# EAGLE design XBee-Adapter_v10 (EAGLE 7.7.0)
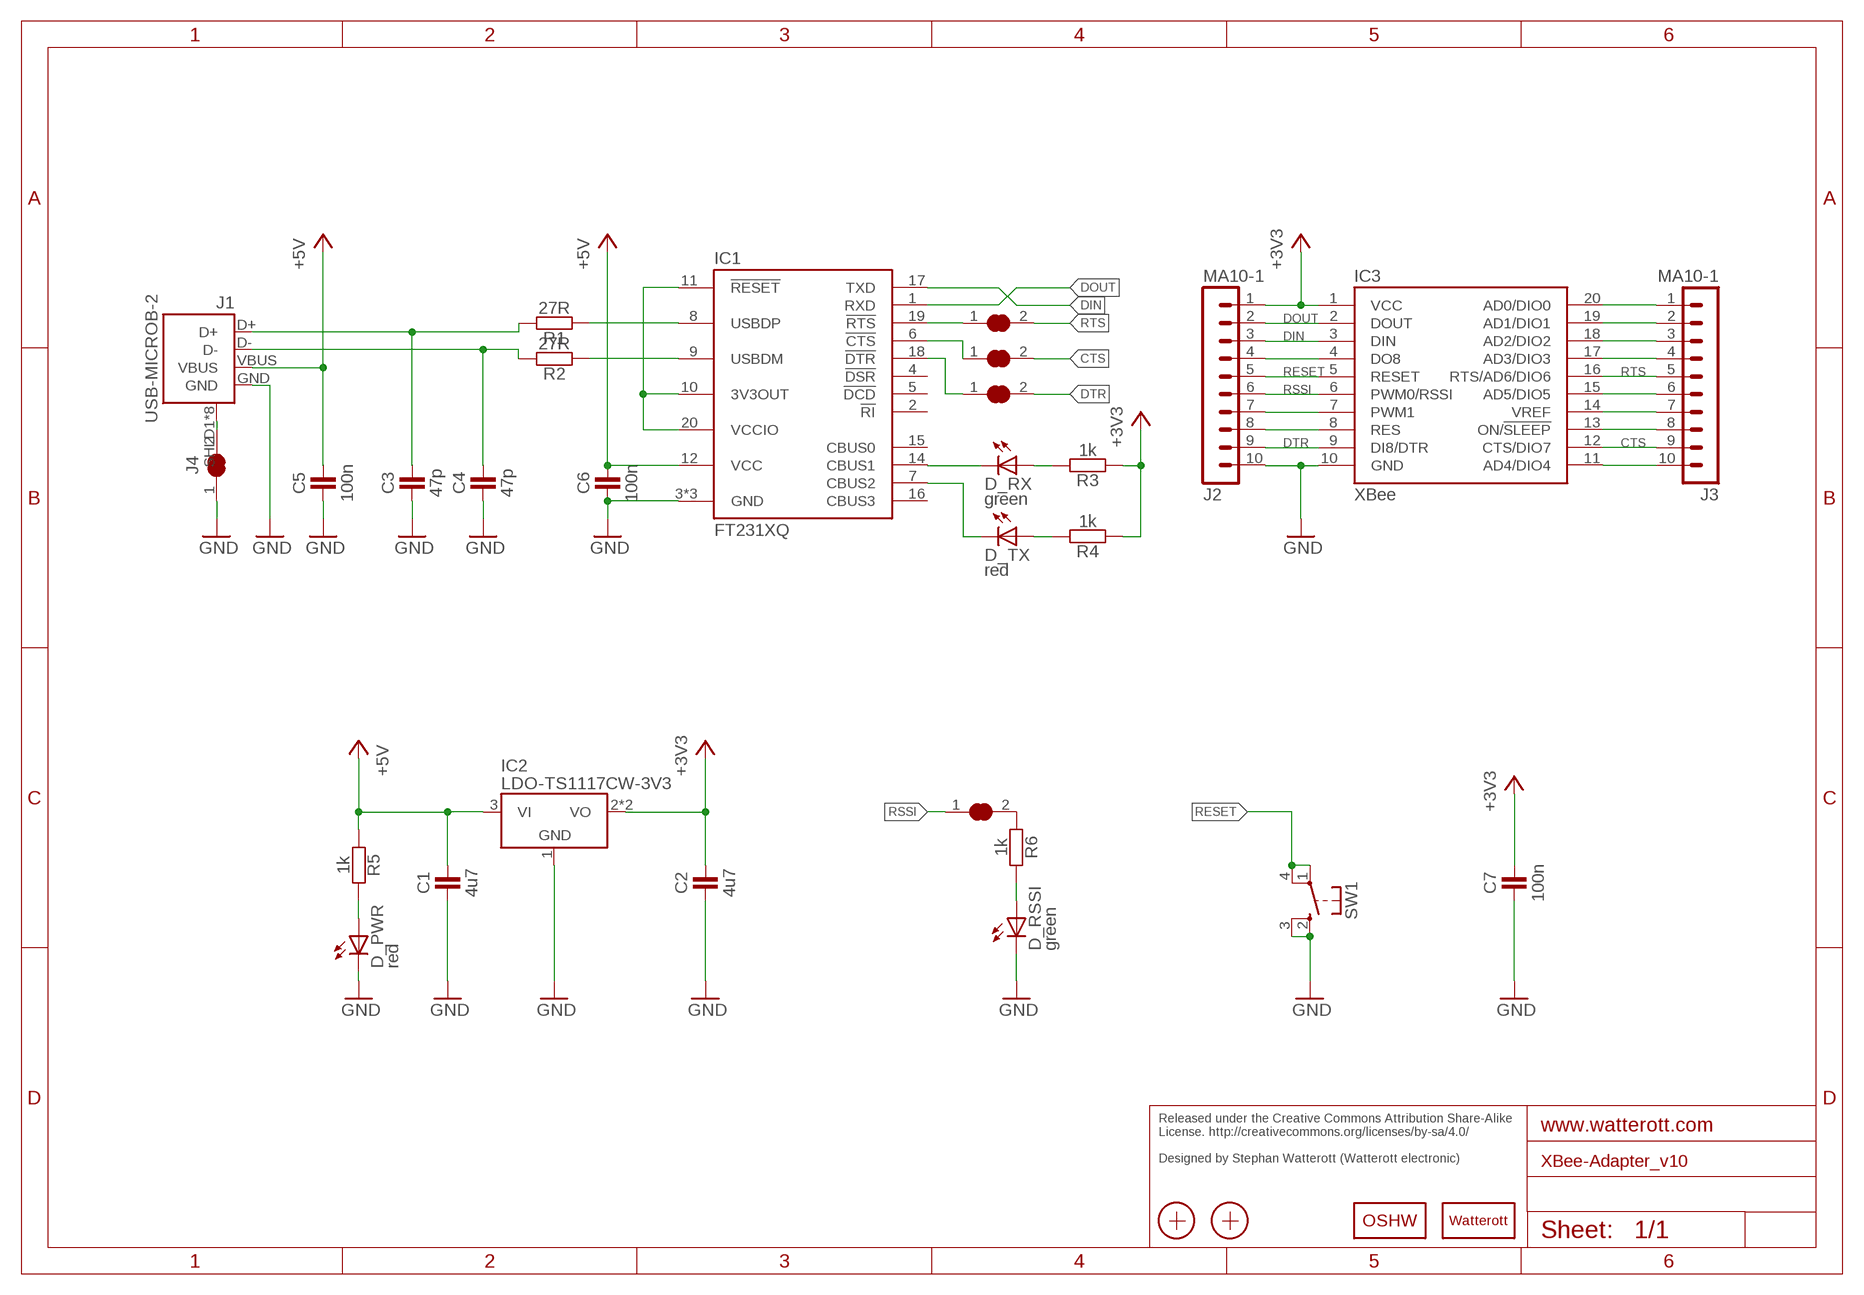
[diagram p0: schematic, sheet 1]

## Parts
C1  4u7  CAPACITOR-0402  [C0402]
C2  4u7  CAPACITOR-0402  [C0402]
C3  47p  CAPACITOR-0402  [C0402]
C4  47p  CAPACITOR-0402  [C0402]
C5  100n  CAPACITOR-0402  [C0402]
C6  100n  CAPACITOR-0402  [C0402]
C7  100n  CAPACITOR-0402  [C0402]
CTS  JUMPER2-0603  [JUMPER2-0603]
D_PWR  red  LED-0603  [C0603]
D_RSSI  green  LED-0603  [C0603]
D_RX  green  LED-0603  [C0603]
D_TX  red  LED-0603  [C0603]
DTR  JUMPER2-0603  [JUMPER2-0603]
IC1  FT231XQ  [QFN20-PAD]
IC2  LDO-TS1117CW-3V3  [SOT223]
IC3  XBee  XBEE  [XBEE]
J1  USB-MICROB-2  [USB-MICROB-10118194]
J2  MA10-1  [MA10-1]
J3  MA10-1  [MA10-1]
J4  JUMPER2-0603  [JUMPER2-0603]
LOGO1  OSHW_LOGOX0150  [OSHW_6X150]
LOGO2  LOGO-S_PLACE_M  [SPARK_TPLACE_M]
R1  27R  RESISTOR-0402  [C0402]
R2  27R  RESISTOR-0402  [C0402]
R3  1k  RESISTOR-0402  [C0402]
R4  1k  RESISTOR-0402  [C0402]
R5  1k  RESISTOR-0402  [C0402]
R6  1k  RESISTOR-0402  [C0402]
RSSI  JUMPER2-0603  [JUMPER2-0603]
RTS  JUMPER2-0603  [JUMPER2-0603]
SW1  SW-TACTILE-TL3315  [SW_TL3315N]
X1  PASSER-07  [PASSER_07MM]
X2  PASSER-07  [PASSER_07MM]

## Nets
+3V3: C2.2 C7.2 IC2.2(VO) IC2.4(VO) IC3.1(VCC) J2.1 R3.1 R4.1
+5V: C1.2 C5.2 C6.2 IC1.12(VCC) IC2.3(VI) J1.VBUS R5.1
CTS: CTS.2 IC3.12(CTS/DIO7) J3.9
D_N: C4.2 J1.D- R2.2
D_P: C3.2 J1.D+ R1.2
DIN: IC1.17(TXD) IC3.3(DIN) J2.3
DOUT: IC1.1(RXD) IC3.2(DOUT) J2.2
DTR: DTR.2 IC3.9(DI8/DTR) J2.9
GND: C1.1 C2.1 C3.1 C4.1 C5.1 C6.1 C7.1 D_PWR.C D_RSSI.C IC1.3(GND) IC1.13(GND) IC1.TP(GND) IC2.1(GND) IC3.10(GND) J1.GND J2.10 J4.1 SW1.2(S1) SW1.3(S2)
N$1: D_PWR.A R5.2
N$2: D_RSSI.A R6.2
N$3: R6.1 RSSI.2
N$6: J1.SHLD1(SHIELD) J1.SHLD2(SHIELD) J1.SHLD3(SHIELD) J1.SHLD4(SHIELD) J1.SHLD5(SHIELD) J1.SHLD6(SHIELD) J1.SHLD7(SHIELD) J1.SHLD8(SHIELD) J4.2
N$8: IC1.19(!RTS) RTS.1
N$10: CTS.1 IC1.6(!CTS)
N$11: D_RX.C IC1.14(CBUS1)
N$12: D_TX.C IC1.7(CBUS2)
N$13: D_RX.A R3.2
N$14: D_TX.A R4.2
N$15: DTR.1 IC1.18(!DTR)
N$17: IC3.4(DO8) J2.4
N$20: IC3.7(PWM1) J2.7
N$21: IC3.8(RES) J2.8
N$23: IC3.20(AD0/DIO0) J3.1
N$24: IC3.19(AD1/DIO1) J3.2
N$25: IC3.18(AD2/DIO2) J3.3
N$26: IC3.17(AD3/DIO3) J3.4
N$27: IC3.15(AD5/DIO5) J3.6
N$28: IC3.14(VREF) J3.7
N$29: IC3.13(ON/!SLEEP) J3.8
N$30: IC3.11(AD4/DIO4) J3.10
RESET: IC3.5(RESET) J2.5 SW1.1 SW1.4(P2)
RSSI: IC3.6(PWM0/RSSI) J2.6 RSSI.1
RTS: IC3.16(RTS/AD6/DIO6) J3.5 RTS.2
USB_N: IC1.9(USBDM) R2.1
USB_P: IC1.8(USBDP) R1.1
VCCIO: IC1.10(3V3OUT) IC1.11(!RESET) IC1.20(VCCIO)
Unconnected: IC1.2(!RI) IC1.4(!DSR) IC1.5(!DCD) IC1.15(CBUS0) IC1.16(CBUS3)

## Notes on the sheet
- Released under the Creative Commons Attribution Share-Alike 
  License. http://creativecommons.org/licenses/by-sa/4.0/
  
  Designed by Stephan Watterott (Watterott electronic)

## Library data of the parts
C1-C7 = we-rcl:CAPACITOR: Capacitors ...4.7uF @ 6.3V -> 0402 ...10uF @ 16V -> 0603 ...22uF @ 25V -> 0805
CTS DTR J4 RSSI RTS = we-rcl:JUMPER2: 2 Pin Jumpers
D_PWR D_RSSI D_RX D_TX = we-opto:LED: LEDs
IC1 = we-chip:FT231X: FTDI FT231X USB to UART Bridge (5V tolerant inputs); DIGIKEY: 768-1128-6-ND
IC2 = we-power:LDO: LDOs TS1117 800mA, Vin max 12V - compatible NCP1117 1A, Vin max 20V TS9011 250mA, Vin max 12V - compatible AP2210 300mA, Vin max 15V TS5204 150mA, Vin max 16V
IC3 = we-board:XBEE: XBEE
J1 = we-con:USB: USB Connectors
J2 J3 = we-con:MA10-1: Pin Header
LOGO1 = we-symbol:OSHW_LOGO: Open-Source-Hardware Logo
LOGO2 = we-symbol:LOGO: Watterott electronic Logo
R1-R6 = we-rcl:RESISTOR: Resistors all kinds in 0603 and 0402
SW1 = we-switch:SW-TACTILE: Tactile Switches; DIGIKEY: EG4621TR-ND
X1 X2 = we-symbol:PASSER: Fiducial Markers

## Board
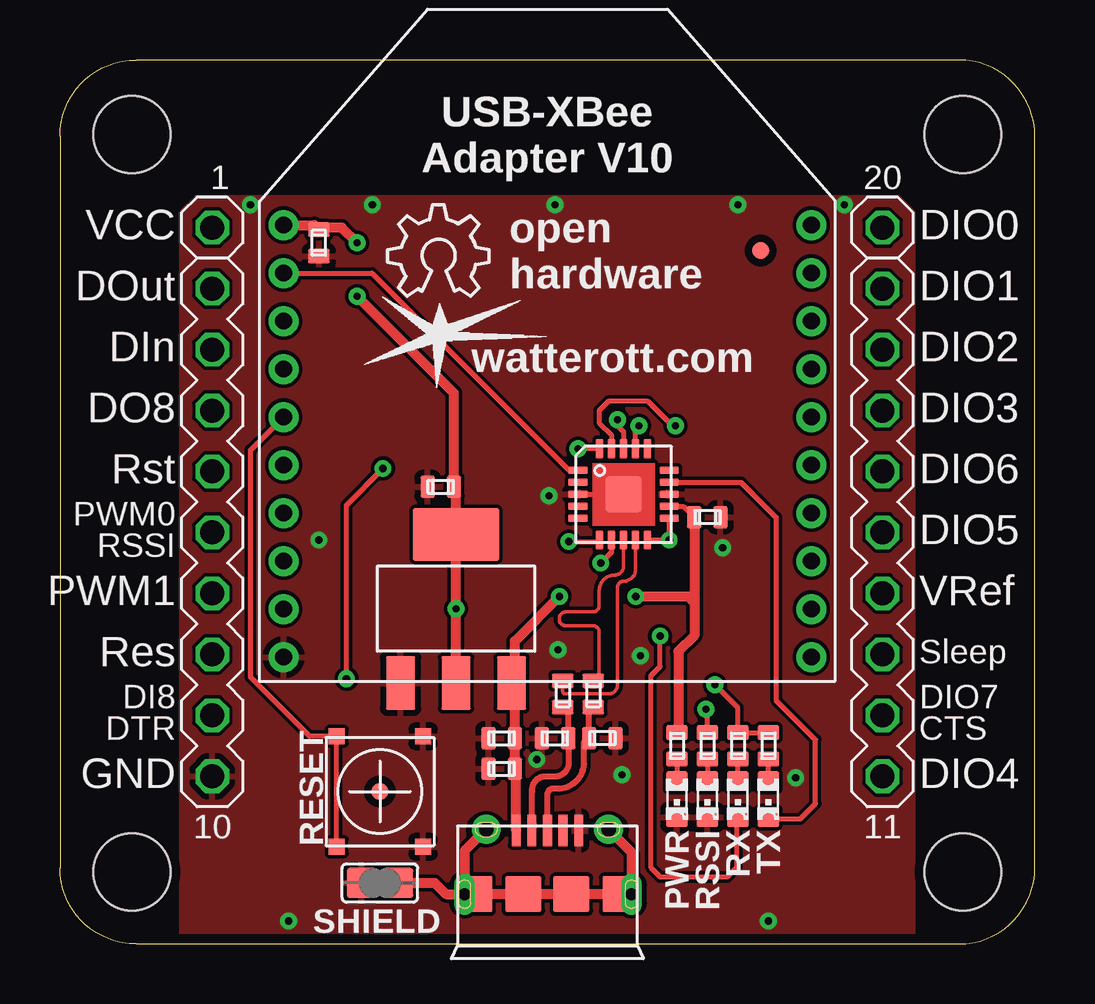
[diagram p1: board, top side]
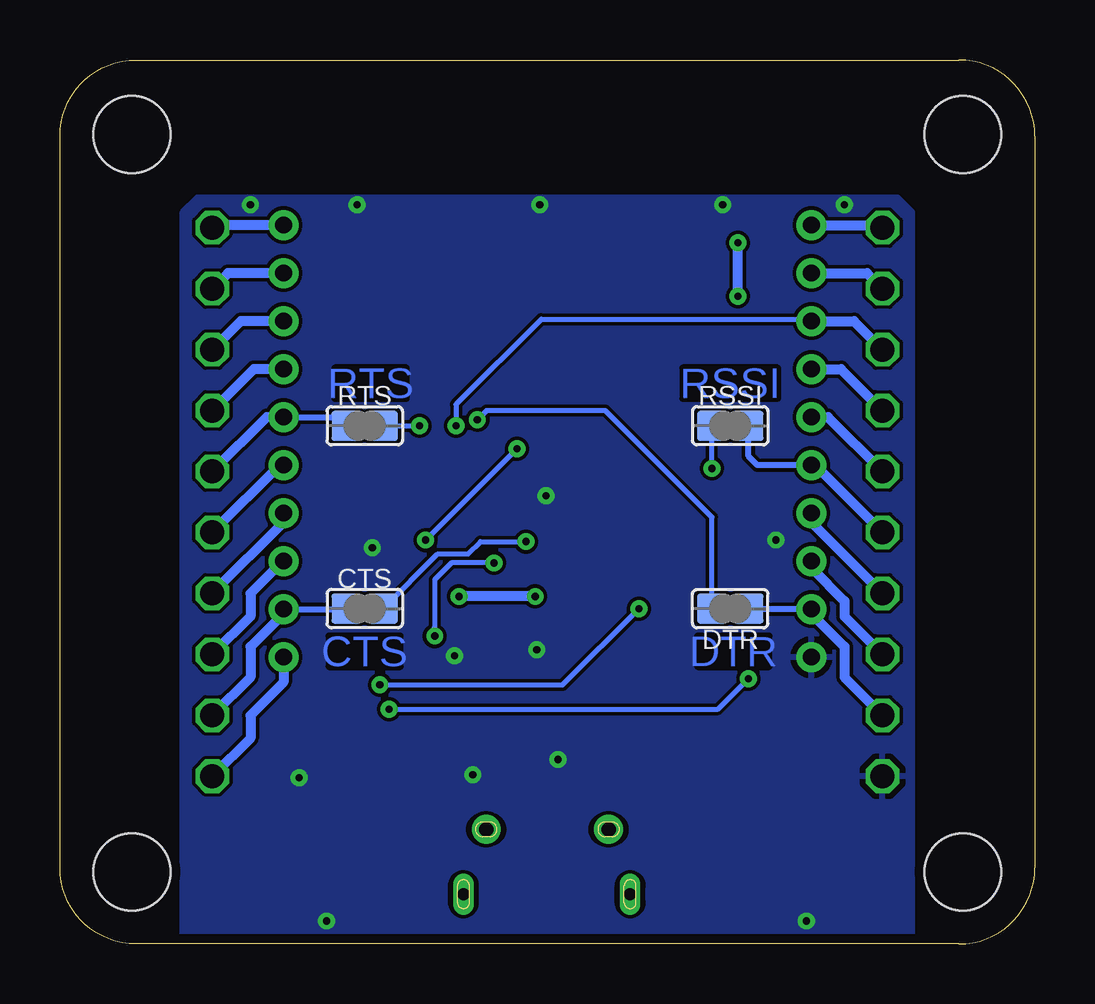
[diagram p2: board, bottom side, seen from below]

Size 40.64 x 36.83 mm. Coordinates in mm from the lower left corner, seen from the top.
Outline: 3.17,0 arc-90 0,3.17 0,33.66 arc-90 3.17,36.83 37.46,36.83 arc-90 40.64,33.66 40.64,3.17 arc-90 37.46,0 3.17,0
Copper layers (1*16): Top 0.035mm / dielectric 1.5mm / Bottom 0.035mm
Design rules "we-dru-2-layer": minimum track width 0.15mm, minimum drill 0.3mm, track to track 0.15mm, track to pad 0.15mm, pad to pad 0.15mm, via to via 0.15mm, smd to smd 0.1mm, copper to edge 0.4mm, drill to drill 0.2mm, minimum pad ring 0.18mm, minimum via ring 0.2mm, stop-mask expansion 0.1mm, vias tented up to drill 0.5mm, thermal gap 0.25mm
Holes 3.2 mm at 3,3 3,33.73 37.64,33.73 37.64,3

### Footprints (pad centres in the part's own frame; a part is rotated, then mirrored left to right if it is on the bottom)
C0402 = smd 0.9 x 0.6: 1 0,0.55; 2 0,-0.55
JUMPER2-0603 = smd 1.25 x 1.25: 1 0,0.76; 2 0,-0.76
C0603 = smd 0.9 x 0.8: A 0,-0.75; C 0,0.75
QFN20-PAD = smd 0.8 x 0.3: 1 -1.9,1; 2 -1.9,0.5; 3 -1.9,0; 4 -1.9,-0.5; 5 -1.9,-1; 11 1.9,-1; 12 1.9,-0.5; 13 1.9,0; 14 1.9,0.5; 15 1.9,1 | smd 0.3 x 0.8: 6 -1,-1.9; 7 -0.5,-1.9; 8 0,-1.9; 9 0.5,-1.9; 10 1,-1.9; 16 1,1.9; 17 0.5,1.9; 18 0,1.9; 19 -0.5,1.9; 20 -1,1.9 | smd 1.5 x 1.5: TP 0,0
SOT223 = smd 2.235 x 1.219: 1 -3.099,2.311; 2 -3.099,0; 3 -3.099,-2.311 | smd 2.2 x 3.6: 4 3.099,0
XBEE = drill 0.7 pad 1.25: 1 -11,9; 2 -11,7; 3 -11,5; 4 -11,3; 5 -11,1; 6 -11,-1; 7 -11,-3; 8 -11,-5; 9 -11,-7; 10 -11,-9; 11 11,-9; 12 11,-7; 13 11,-5; 14 11,-3; 15 11,-1; 16 11,1; 17 11,3; 18 11,5; 19 11,7; 20 11,9
USB-MICROB-10118194 = smd 1.3 x 0.4: D+ -2.5,0; D- -2.5,-0.65; GND -2.5,1.3; ID -2.5,0.65; VBUS -2.5,-1.3 | drill 0.6 pad 1.2: SHLD1 -2.55,2.55; SHLD2 -2.55,-2.55 | drill 0.5 pad 0.8 long: SHLD3 0.15,3.5; SHLD4 0.15,-3.45 | smd 1.5 x 1.1: SHLD5 0.15,2.85; SHLD6 0.15,-2.85 | smd 1.5 x 1.5: SHLD7 0.15,1; SHLD8 0.15,-1
MA10-1 = drill 1 octagon: 1 0,11.43; 2 0,8.89; 3 0,6.35; 4 0,3.81; 5 0,1.27; 6 0,-1.27; 7 0,-3.81; 8 0,-6.35; 9 0,-8.89; 10 0,-11.43
SW_TL3315N = smd 0.65 x 0.7: 1 -2.3,1.8; 2 -2.3,-1.8; 3 2.3,-1.8; 4 2.3,1.8
PASSER_07MM = smd 0.7 x 0.7: X 0,0

### Placement (x,y rotation side)
C1  18.41,8.57 90 top
C2  15.88,19.05 90 top
C3  22.61,8.57 270 top
C4  20.64,8.57 90 top
C5  18.41,7.3 90 top
C6  26.99,17.78 270 top
C7  10.79,29.21 180 top
CTS  27.94,13.97 270 bottom
D_PWR  25.72,6.03 180 top
D_RSSI  26.99,6.03 180 top
D_RX  29.53,6.03 180 top
D_TX  28.26,6.03 180 top
DTR  12.7,13.97 90 bottom
IC1  23.49,18.73 0 top
IC2  16.51,13.97 90 top
IC3  20.32,20.95 0 top
J1  20.32,2.22 270 top
J2  6.35,18.41 0 top
J3  34.29,18.41 0 top
J4  13.34,2.54 90 top
LOGO1  13.65,26.99 0 top
LOGO2  15.88,25.4 0 top
R1  22.23,10.41 0 top
R2  20.95,10.41 0 top
R3  29.53,8.26 0 top
R4  28.26,8.26 0 top
R5  25.72,8.26 0 top
R6  26.99,8.26 0 top
RSSI  12.7,21.59 270 bottom
RTS  27.94,21.59 270 bottom
SW1  13.34,6.35 90 top
X1  13.34,6.35 0 top
X2  29.21,28.89 0 top

### Tracks (layer width: path | path; a pad name or v marks a point on that pad's centre or on a via)
+3V3  (via drill 0.3)
  Top 0.2: R3.1 R4.1 28.26,9.84 v27.3,10.79
  Top 0.406: IC3.1 10.6,29.95 C7.2 10.88,29.84 11.75,29.84 v12.38,29.21 | v12.38,26.99 16.43,22.95 C2.2 16.51,18.96 IC2.4 v16.51,13.97 IC2.2
  Bottom 0.2: v27.3,10.79 19.69,10.79 v16.51,13.97
  Bottom 0.406: v12.38,26.99 v12.38,29.21 | IC3.1 6.46,29.95 J2.1
+5V  (via drill 0.3)
  Top 0.2: IC1.12 25.98,18.23 C6.2
  Top 0.406: J1.VBUS 19.02,7.25 C5.2 C1.2 | C1.2 18.96,10.73 IC2.3 | C6.2 26.44,14.22 | 26.44,14.22 26.44,12.85 25.78,12.19 25.78,8.87 R5.1 | C1.2 18.96,12.62 v20.83,14.48 | v24,14.48 26.18,14.48 26.44,14.22
  Bottom 0.406: v20.83,14.48 v24,14.48
CTS
  Bottom 0.254: IC3.12 28.72,13.96 CTS.2
  Bottom 0.406: IC3.12 31.32,13.77 32.7,12.38 32.7,11.11 J3.9
D_N
  Top 0.254: J1.D- arc90 19.69,5.12 19.69,6.35 arc-90 20.19,6.99 20.57,6.99 arc90 21.21,7.49 21.21,8.55 arc90 C4.2 21.19,9.7 arc90 R2.2
D_P
  Top 0.254: J1.D+ 20.32,6.22 arc-90 20.57,6.48 20.7,6.48 arc90 21.84,7.49 21.84,8.36 arc-90 C3.2 22.06,9.7 arc-90 R1.2
DIN  (via drill 0.3)
  Top 0.2: IC1.17 23.99,21.45 v24.13,21.59
  Bottom 0.2: IC3.3 9.4,26.04 20.57,26.04 24.13,22.48 v24.13,21.59
  Bottom 0.406: IC3.3 7.54,25.95 J2.3
DOUT
  Top 0.2: IC1.1 21.23,19.73 13,27.95 IC3.2
  Bottom 0.406: IC3.2 7,27.95 J2.2
DTR
  Bottom 0.254: IC3.9 11.93,13.96 DTR.2
  Bottom 0.406: IC3.9 9.32,13.77 7.94,12.38 7.94,11.11 J2.9
GND  (via drill 0.3)
  Top 0.2: IC1.3 IC1.TP
  other vias: 27.62,16.51 13.02,30.8 28.26,30.8 9.53,0.95 29.53,0.95 20.64,30.8 24.19,12 10.79,16.83 7.94,30.8 32.7,30.8 23.43,7.05 19.88,7.68 20.76,12.26 20.38,18.67 30.67,6.92
  pour Top: 5.08,0 5.08,30.48 5.71,31.11 34.92,31.11 35.56,30.48 35.56,0
  pour Bottom: 5.71,31.11 34.92,31.11 35.56,30.48 35.56,0 5.08,0 5.08,30.48
N$1
  Top 0.2: R5.2 D_PWR.A
N$2
  Top 0.2: R6.2 D_RSSI.A
N$3  (via drill 0.3)
  Top 0.2: R6.1 26.99,9.72 v26.92,9.78 | v11.94,11.05 11.94,18.29 v13.46,19.81
  Bottom 0.2: v26.92,9.78 13.21,9.78 v11.94,11.05 | v13.46,19.81 RSSI.2
N$4
  Bottom 0.2: 11.94,21.59 13.59,21.59
N$5
  Bottom 0.2: 27.3,21.59 28.83,21.59
N$6
  Top 0.2: J1.SHLD6 J1.SHLD4
  Top 0.406: J1.SHLD1 23.82,3.82 J1.SHLD3 J1.SHLD5 J1.SHLD7 J1.SHLD8 J1.SHLD6 | J1.SHLD2 16.87,3.87 J1.SHLD4 16.09,2.07 15.62,2.54 J4.2
N$8  (via drill 0.3)
  Top 0.2: v25.65,21.59 25.53,21.59 24.51,22.61 22.86,22.61 22.48,22.23 22.48,21.72 22.99,21.21 IC1.19
  Bottom 0.2: RTS.1 v25.65,21.59
N$9
  Top 0.2: 12.7,2.54 13.97,2.54
N$10  (via drill 0.3)
  Top 0.2: v21.21,16.76 22.43,16.76 IC1.6
  Bottom 0.2: v21.21,16.76 23.11,16.76 23.62,16.26 24.89,16.26 CTS.1 28.7,13.97
N$11
  Top 0.2: IC1.14 28.39,19.23 29.84,17.78 29.84,10.16 31.5,8.51 31.5,5.84 30.86,5.21 29.6,5.21 D_RX.C
N$12  (via drill 0.3)
  Top 0.2: IC1.7 22.99,16.33 v22.54,15.88 | D_TX.C 28.19,5.22 28.19,3.17 27.81,2.79 25.02,2.79 24.64,3.17 24.64,11.18 25.02,11.56 v25.02,12.83
  Bottom 0.2: v22.54,15.88 24.32,15.88 25.02,15.18 v25.02,12.83 25.02,13.21
N$13
  Top 0.2: D_RX.A R3.2
N$14
  Top 0.2: D_TX.A R4.2
N$15  (via drill 0.3)
  Top 0.2: v23.24,21.84 23.24,21.59 23.49,21.34 IC1.18
  Bottom 0.2: DTR.1 13.46,17.78 17.91,22.23 22.86,22.23 v23.24,21.84
N$16
  Bottom 0.2: 11.94,13.97 13.59,13.97
N$17
  Bottom 0.406: IC3.4 8.08,23.95 J2.4
N$20
  Bottom 0.406: IC3.7 9.32,17.57 J2.7
N$21
  Bottom 0.406: IC3.8 9.32,15.67 7.94,14.29 7.94,13.65 J2.8
N$23
  Bottom 0.406: IC3.20 34.18,29.95 J3.1
N$24
  Bottom 0.406: IC3.19 33.64,27.95 J3.2
N$25
  Bottom 0.406: IC3.18 33.1,25.95 J3.3
N$26
  Bottom 0.406: IC3.17 32.56,23.95 J3.4
N$27
  Bottom 0.406: IC3.15 31.48,19.95 J3.6
N$28
  Bottom 0.406: IC3.14 31.32,17.57 J3.7
N$29
  Bottom 0.406: IC3.13 31.35,15.96 32.7,14.61 32.7,13.65 J3.8
N$30
  Bottom 0.406: IC3.11 31.32,10.91 32.7,9.53 32.7,8.57 J3.10
RESET
  Top 0.2: SW1.1 SW1.4 10.4,8.65 7.94,11.11 7.94,20.57 IC3.5
  Bottom 0.406: IC3.5 8.62,21.95 J2.5
RSSI
  Bottom 0.254: IC3.6 11.57,19.95 11.94,20.32 RSSI.1
  Bottom 0.406: IC3.6 9.16,19.95 J2.6
RTS
  Bottom 0.254: IC3.16 29.06,21.95 RTS.2
  Bottom 0.406: IC3.16 32.02,21.95 J3.5
USB_N
  Top 0.152: R2.1 20.95,10.54 arc90 21.08,10.41 22.86,10.41 arc90 23.24,10.79 23.24,14.86 arc-90 23.49,15.11 arc90 23.99,15.61 IC1.9
USB_P
  Top 0.152: R1.1 arc90 22.48,11.22 22.48,12.99 arc90 22.21,13.26 21.08,13.26 arc-90 20.81,13.53 20.81,13.56 arc-90 21.08,13.83 22.21,13.83 arc90 22.48,14.1 22.48,14.73 arc-90 23.11,15.37 arc90 23.49,15.75 IC1.8
VCCIO  (via drill 0.3)
  Top 0.2: IC1.20 v21.59,20.63 v21.59,20.64 | IC1.11 v25.4,16.83 IC1.10
  Bottom 0.2: v21.59,20.64 v25.4,16.83

### Text on the board
Bottom: RSSI | RTS | DTR | CTS
tPlace: USB-XBee / Adapter V10 | 1 | 20 | VCC | DIO0 | open / hardware | DOut | DIO1 | DIn | DIO2 | watterott.com | DO8 | DIO3 | Rst | DIO6 | PWM0 / RSSI | DIO5 | PWM1 | VRef | Res | Sleep | DI8 / DTR | DIO7 / CTS | RESET | GND | DIO4 | 10 | PWR | RSSI | RX | TX | 11 | SHIELD
Reference: Silkscreen: 21 tPlace